# EAGLE schematic WallSwitch (EAGLE 8.0.1)
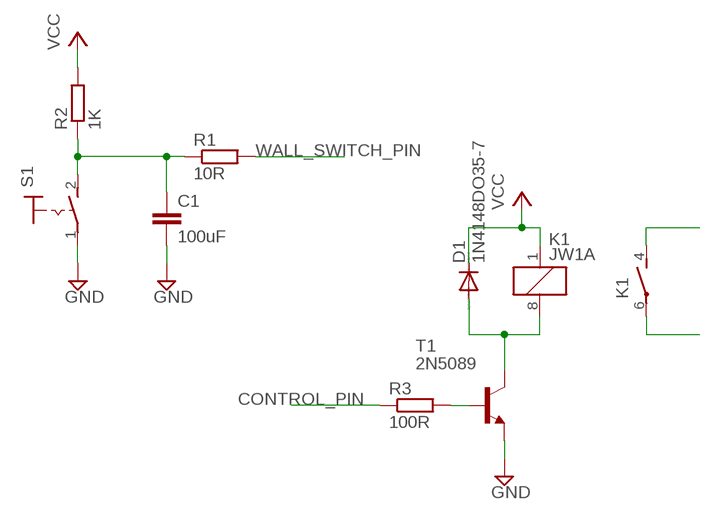
[diagram p0: schematic, sheet 1]

## Parts
C1  100uF  C-EU025-024X044  [C025-024X044]
D1  1N4148DO35-7  [DO35-7]
K1  JW1A  [JW1A]
R1  10R  R-EU_0204/5  [0204/5]
R2  1K  R-EU_0204/5  [0204/5]
R3  100R  R-EU_0204/5  [0204/5]
S1  MS243  [MS243]
T1  2N5089  [TO92]

## Nets
CONTROL_PIN: R3.1
GND: S1.1(P) T1.3(E)
N$1: C1.1 R1.1 R2.1 S1.2(S)
N$2: C1.2 ; supply symbol labelled GND
N$4: R3.2 T1.2(B)
N$6: D1.A K1.8 T1.1(C)
N$8: K1.6(1:P)
N$9: K1.4(1:S)
VCC: D1.C K1.1 R2.2
WALL_SWITCH_PIN: R1.2

## Library data of the parts
C1 = resistor:C-EU: CAPACITOR, European symbol
D1 = diode:1N4148: DIODE high speed (Philips)
K1 = relay:JW1A: Power relay Source: Panasonic Electric Works Co., Ltd. / jw.catalog.pdf
R1-R3 = resistor:R-EU_: RESISTOR, European symbol
S1 = switch:MS243: TOGGLE SWITCH
T1 = transistor:2N5089: NPN TRANSISTOR